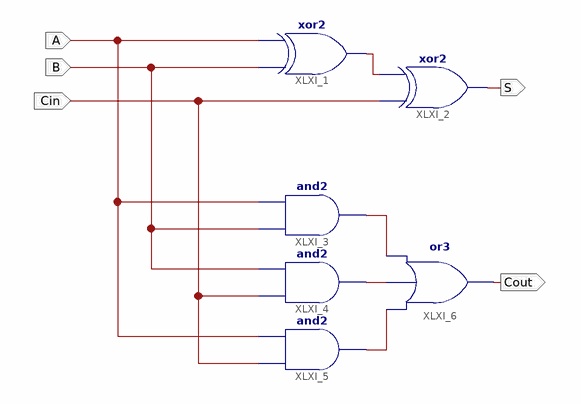
[diagram p0: schematic sheet 1]
// Xilinx ISE schematic Adder1b.sch (kintex7) as structural Verilog: 6 symbols, 5 ports
module Adder1b (
  input  A,
  input  B,
  input  Cin,
  output S,
  output Cout
);

  wire XLXN_1, XLXN_8, XLXN_9, XLXN_10;

  xor XLXI_1 (XLXN_1, B, A);
  xor XLXI_2 (S, Cin, XLXN_1);
  and XLXI_3 (XLXN_8, B, A);
  and XLXI_4 (XLXN_9, Cin, B);
  and XLXI_5 (XLXN_10, Cin, A);
  or XLXI_6 (Cout, XLXN_10, XLXN_9, XLXN_8);
endmodule
